# EAGLE design pentabug_v2 (EAGLE 6.5.0)

## Sheet 1 of 4
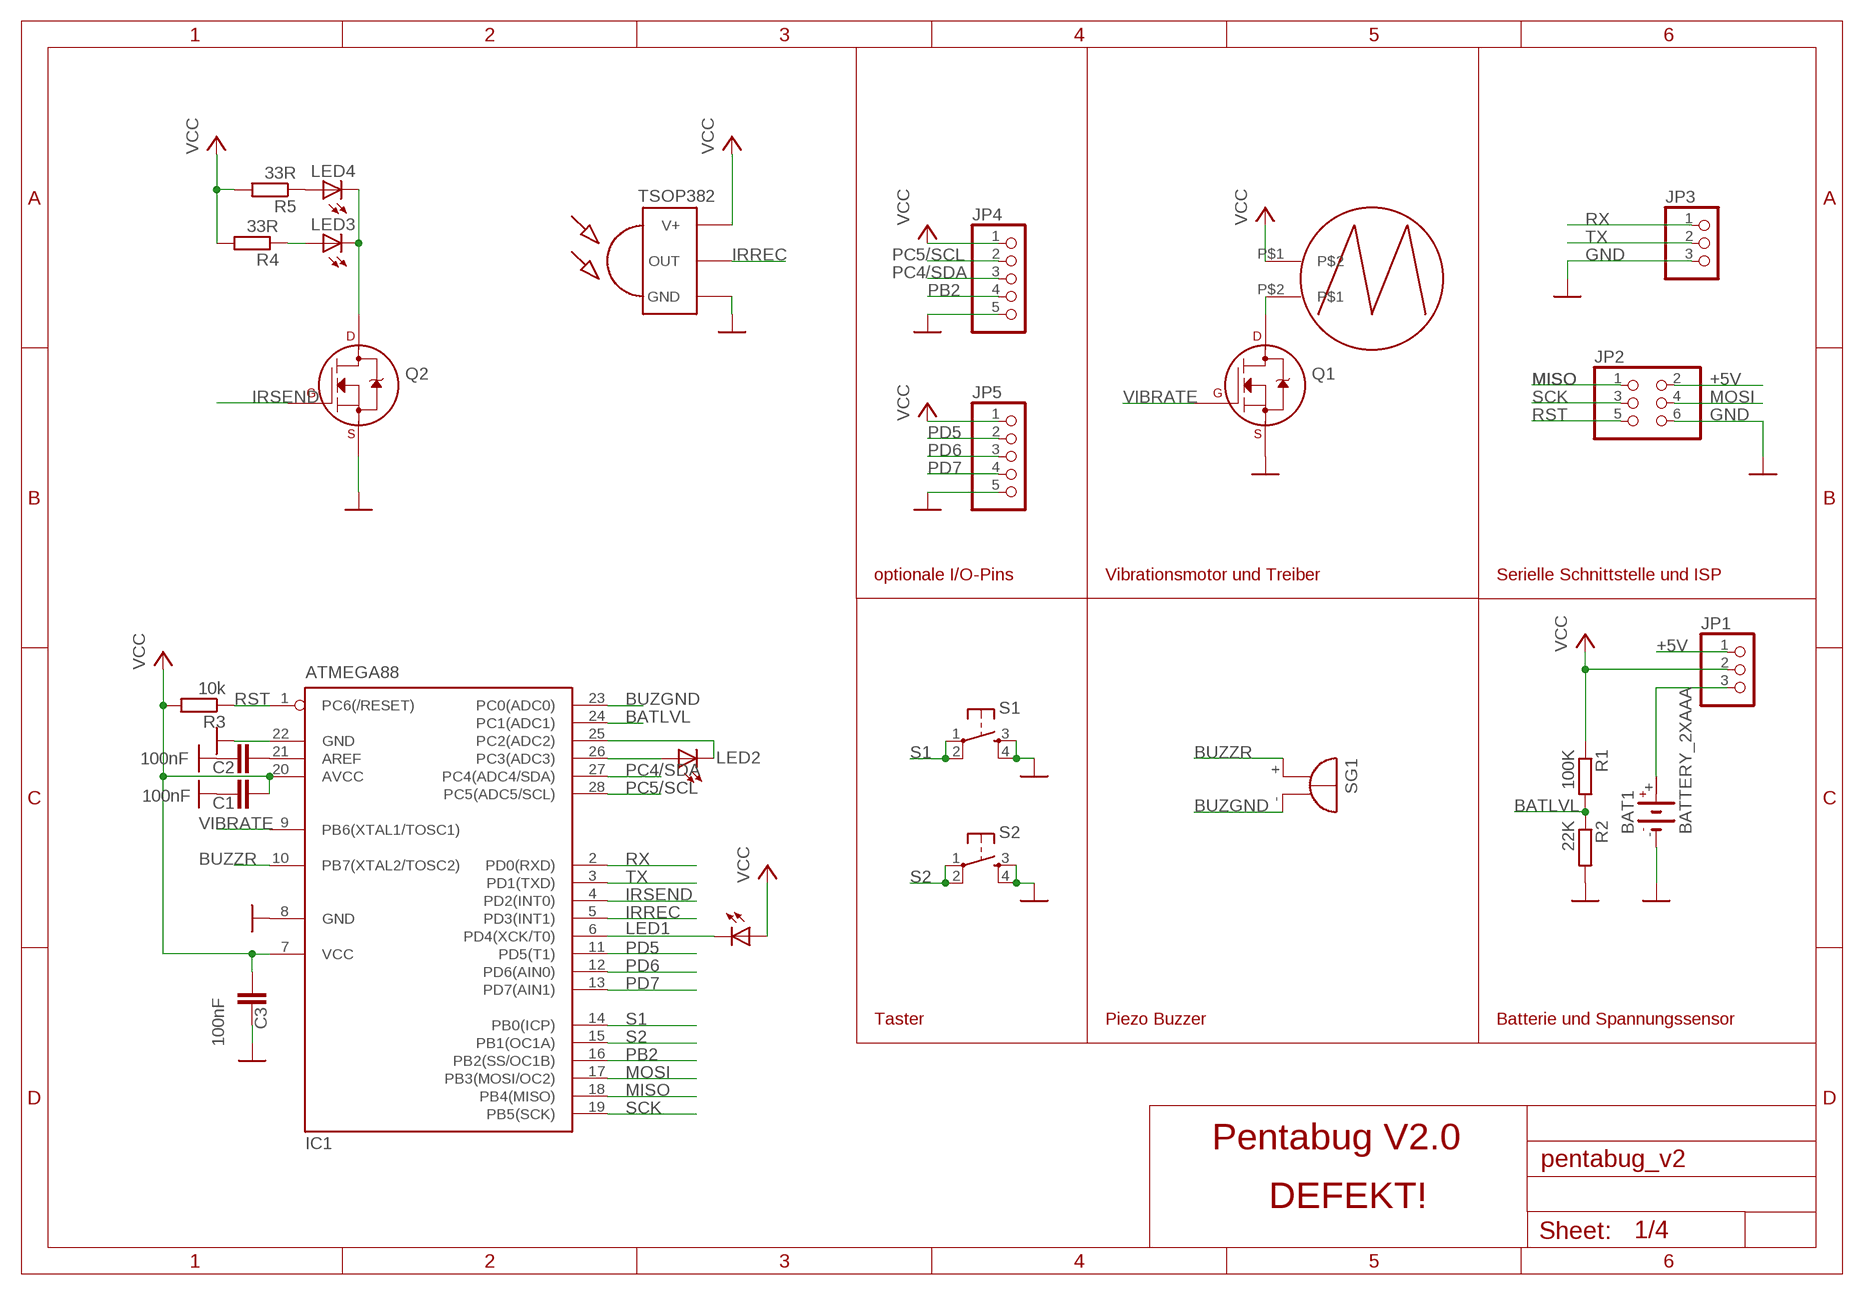
[diagram p0: schematic, sheet 1]

### Parts
BAT1  BATTERY_2XAAA  [BATTERY_2XAAA_SMALLPINS]
C1  100nF  C-EU025-024X044  [C025-024X044]
C2  100nF  C-EU025-024X044  [C025-024X044]
C3  100nF  C-EU025-024X044  [C025-024X044]
IC1  ATMEGA88  MEGA8-P  [DIL28-3]
IR  TSOP382  [TSOP382]
JP1  PINHD-1X3  [1X03]
JP2  PINHD-2X3  [2X03]
JP3  PINHD-1X3  [1X03]
JP4  PINHD-1X5  [1X05]
JP5  PINHD-1X5  [1X05]
LED1  LED5MM  [LED5MM]
LED2  LED5MM  [LED5MM]
LED3  LED3MM  [LED3MM]
LED4  LED3MM  [LED3MM]
Q1  2N7000_TO92  [TO-92]
Q2  2N7000_TO92  [TO-92]
R1  100K  R-EU_0207/10  [0207/10]
R2  22K  R-EU_0207/10  [0207/10]
R3  10k  R-EU_0207/10  [0207/10]
R4  33R  R-EU_0207/10  [0207/10]
R5  33R  R-EU_0207/10  [0207/10]
S1  TAC_SWITCHPTH  [TACTILE-PTH]
S2  TAC_SWITCHPTH  [TACTILE-PTH]
SG1  MULTIBUZZRTDKBUZZR  [BUZZRTDK]
U$1  VIBRAMOTOR  [LA4-432]

### Nets
+5V: JP1.1 JP2.2
BAT: BAT1.+ JP1.3
BATLVL: IC1.24(PC1(ADC1)) R1.2 R2.1
BUZGND: IC1.23(PC0(ADC0)) SG1.-
BUZZR: IC1.10(PB7(XTAL2/TOSC2)) SG1.+
GND: BAT1.- C1.1 C2.1 C3.1 IC1.8(GND) IC1.22(GND) IR.GND JP2.6 JP3.3 JP4.5 JP5.5 Q1.1(S) Q2.1(S) R2.2 S1.3 S1.4 S2.3 S2.4
IRREC: IC1.5(PD3(INT1)) IR.OUT
IRSEND: IC1.4(PD2(INT0)) Q2.2(G)
MISO: IC1.18(PB4(MISO)) JP2.1
MOSI: IC1.17(PB3(MOSI/OC2)) JP2.4
N$3: IC1.26(PC3(ADC3)) LED2.A
N$5: IC1.25(PC2(ADC2)) LED2.K(C)
N$7: LED4.A R5.1
N$8: Q1.3(D) U$1.P$2
N$10: LED3.A R4.1
N$11: LED3.K(C) LED4.K(C) Q2.3(D)
N$12: IC1.6(PD4(XCK/T0)) LED1.K(C)
N$17: C2.2 IC1.21(AREF)
PB2: IC1.16(PB2(SS/OC1B)) JP4.4
PC4/SDA: IC1.27(PC4(ADC4/SDA)) JP4.3
PC5/SCL: IC1.28(PC5(ADC5/SCL)) JP4.2
PD5: IC1.11(PD5(T1)) JP5.2
PD6: IC1.12(PD6(AIN0)) JP5.3
PD7: IC1.13(PD7(AIN1)) JP5.4
RST: IC1.1(PC6(/RESET)) JP2.5 R3.1
RX: IC1.2(PD0(RXD)) JP3.1
S1: IC1.14(PB0(ICP)) S1.1 S1.2
S2: IC1.15(PB1(OC1A)) S2.1 S2.2
SCK: IC1.19(PB5(SCK)) JP2.3
TX: IC1.3(PD1(TXD)) JP3.2
VCC: C1.2 C3.2 IC1.7(VCC) IC1.20(AVCC) IR.VCC(V+) JP1.2 JP4.1 JP5.1 LED1.A R1.1 R3.2 R4.2 R5.2 U$1.P$1
VIBRATE: IC1.9(PB6(XTAL1/TOSC1)) Q1.2(G)

### Notes on the sheet
- optionale I/O-Pins | Vibrationsmotor und Treiber | Serielle Schnittstelle und ISP
- Taster | Piezo Buzzer | Batterie und Spannungssensor
- Pentabug V2.0
- DEFEKT!

## Sheet 2 of 4
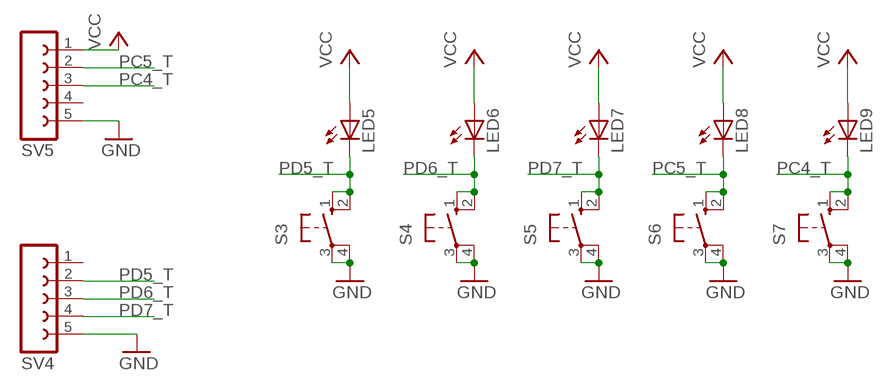
[diagram p1: schematic, sheet 2]

### Parts
LED5  LED5MM  [LED5MM]
LED6  LED5MM  [LED5MM]
LED7  LED5MM  [LED5MM]
LED8  LED5MM  [LED5MM]
LED9  LED5MM  [LED5MM]
S3  10-XX  [B3F-10XX]
S4  10-XX  [B3F-10XX]
S5  10-XX  [B3F-10XX]
S6  10-XX  [B3F-10XX]
S7  10-XX  [B3F-10XX]
SV4  FE05-1  [FE05-1]
SV5  FE05-1  [FE05-1]

### Nets
GND_M: S3.3(P) S3.4(P1) S4.3(P) S4.4(P1) S5.3(P) S5.4(P1) S6.3(P) S6.4(P1) S7.3(P) S7.4(P1) SV4.5 SV5.5 ; supply symbol labelled GND
PC4_T: LED9.K(C) S7.1(S) S7.2(S1) SV5.3
PC5_T: LED8.K(C) S6.1(S) S6.2(S1) SV5.2
PD5_T: LED5.K(C) S3.1(S) S3.2(S1) SV4.2
PD6_T: LED6.K(C) S4.1(S) S4.2(S1) SV4.3
PD7_T: LED7.K(C) S5.1(S) S5.2(S1) SV4.4
VCC_M: LED5.A LED6.A LED7.A LED8.A LED9.A SV5.1 ; supply symbol labelled VCC
Unconnected: SV4.1 SV5.4

## Sheet 3 of 4
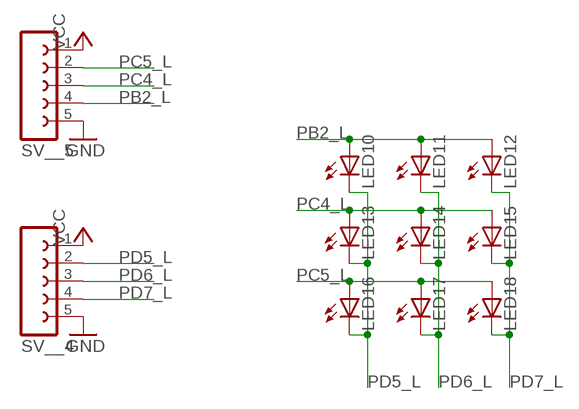
[diagram p2: schematic, sheet 3]

### Parts
LED10  LED5MM  [LED5MM]
LED11  LED5MM  [LED5MM]
LED12  LED5MM  [LED5MM]
LED13  LED5MM  [LED5MM]
LED14  LED5MM  [LED5MM]
LED15  LED5MM  [LED5MM]
LED16  LED5MM  [LED5MM]
LED17  LED5MM  [LED5MM]
LED18  LED5MM  [LED5MM]
SV__4  FE05-1  [FE05-1]
SV__5  FE05-1  [FE05-1]

### Nets
GND_L: SV__4.5 SV__5.5 ; supply symbol labelled GND
PB2_L: LED10.A LED11.A LED12.A SV__5.4
PC4_L: LED13.A LED14.A LED15.A SV__5.3
PC5_L: LED16.A LED17.A LED18.A SV__5.2
PD5_L: LED10.K(C) LED13.K(C) LED16.K(C) SV__4.2
PD6_L: LED11.K(C) LED14.K(C) LED17.K(C) SV__4.3
PD7_L: LED12.K(C) LED15.K(C) LED18.K(C) SV__4.4
VCC_L: SV__4.1 SV__5.1 ; supply symbol labelled VCC

## Sheet 4 of 4

## Library data of the parts
BAT1 = buglbr:BATTERY_2XAAA: Farnell Battery Holder 2x AAA Farnell # 1650679
C1-C3 = resistor:C-EU: CAPACITOR, European symbol
IC1 = atmel:MEGA8-P: MICROCONTROLLER 8 Kbytes FLASH, 1 kbytes SRAM, 512 bytes EEPROM, USART, 4-channel 10 bit ADC, 2-channel 8 bit ADC Pin compatible with Atmega48, ATMega88, ATMega168 Source: avr.lbr; OC_FARNELL: unknown; OC_NEWARK: unknown
IR = buglbr:TSOP382: IR Receiver and Demodulator
JP1 JP3 = pinhead:PINHD-1X3: PIN HEADER
JP2 = pinhead:PINHD-2X3: PIN HEADER
JP4 JP5 = pinhead:PINHD-1X5: PIN HEADER
LED1-LED4 = SparkFun:LED: LEDs Standard schematic elements and footprints for 5mm, 3mm, 1206, and 0603 sized LEDs. 5mm - Spark Fun Electronics SKU : COM-00529 (and others)
LED5-LED18 = led:LED: LED OSRAM: - CHIPLED LG R971, LG N971, LY N971, LG Q971, LY Q971, LO R971, LY R971 LH N974, LH R974 LS Q976, LO Q976, LY Q976 LO Q996 - Hyper CHIPLED LW Q18S LB Q993, LB Q99A, LB R99A - SideLED LS A670, LO A670, LY A670, LG A670, LP A670 LB A673, LV A673, LT A673, LW A673 LH A674 LY A675 LS A676, LA A676, LO A676, LY A676, LW A676 LS A679, LY A679, LG A679 - Hyper Micro SIDELED® LS Y876, LA Y876, LO Y876, LY Y876 LT Y87S - SmartLED LW L88C, LW L88S LB L89C, LB L89S, LG L890 LS L89K, LO L89K, LY L89K LS L896, LA L896, LO L896, LY L896 - TOPLED LS T670, LO T670, LY T670, LG T670, LP T670 LSG T670, LSP T670, LSY T670, LOP T670, LYG T670 LG T671, LOG T671, LSG T671 LB T673, LV T673, LT T673, LW T673 LH T674 LS T676, LA T676, LO T676, LY T676, LB T676, LH T676, LSB T676, LW T676 LB T67C, LV T67C, LT T67C, LS T67K, LO T67K, LY T67K, LW E67C LS E67B, LA E67B, LO E67B, LY E67B, LB E67C, LV E67C, LT E67C LW T67C LS T679, LY T679, LG T679 LS T770, LO T770, LY T770, LG T770, LP T770 LB T773, LV T773, LT T773, LW T773 LH T774 LS E675, LA E675, LY E675, LS T675 LS T776, LA T776, LO T776, LY T776, LB T776 LHGB T686 LT T68C, LB T68C - Hyper Mini TOPLED® LB M676 - Mini TOPLED Santana® LG M470 LS M47K, LO M47K, LY M47K Source: http://www.osram.convergy.de LUXEON: - LUMILED® LXK2-PW12-R00, LXK2-PW12-S00, LXK2-PW14-U00, LXK2-PW14-V00 LXK2-PM12-R00, LXK2-PM12-S00, LXK2-PM14-U00 LXK2-PE12-Q00, LXK2-PE12-R00, LXK2-PE12-S00, LXK2-PE14-T00, LXK2-PE14-U00 LXK2-PB12-K00, LXK2-PB12-L00, LXK2-PB12-M00, LXK2-PB14-N00, LXK2-PB14-P00, LXK2-PB14-Q00 LXK2-PR12-L00, LXK2-PR12-M00, LXK2-PR14-Q00, LXK2-PR14-R00 LXK2-PD12-Q00, LXK2-PD12-R00, LXK2-PD12-S00 LXK2-PH12-R00, LXK2-PH12-S00 LXK2-PL12-P00, LXK2-PL12-Q00, LXK2-PL12-R00 Source: www.luxeon.com KINGBRIGHT: KA-3528ASYC Source: www.kingbright.com
Q1 Q2 = transistors:2N700*: 2N7000, 2N7002, NDS7002A N-channel enhancement mode MOSFET
R1-R5 = rcl:R-EU_: RESISTOR, European symbol
S1 S2 = SparkFun:TAC_SWITCH: Momentary Switch Button commonly used for reset or general input. Spark Fun Electronics SKU : COM-00097
S3-S7 = switch-omron:10-XX: OMRON SWITCH; MPN: B3F-1000; OC_FARNELL: 176432; OC_NEWARK: 36M3542
SG1 = buglbr:MULTIBUZZR: BUZZER TDK PS1720P02 http://de.mouser.com/ProductDetail/TDK/PS1720P02/?qs=%2fha2pyFadujtCAfY3DKBdXuzQLwQogEgrqwqrrNaKDmjrMwApyDRCA%3d%3d
SV4 SV5 SV__4 SV__5 = con-lsta:FE05-1: FEMALE HEADER; OC_FARNELL: unknown; OC_NEWARK: unknown
U$1 = buglbr:VIBRAMOTOR

## Board
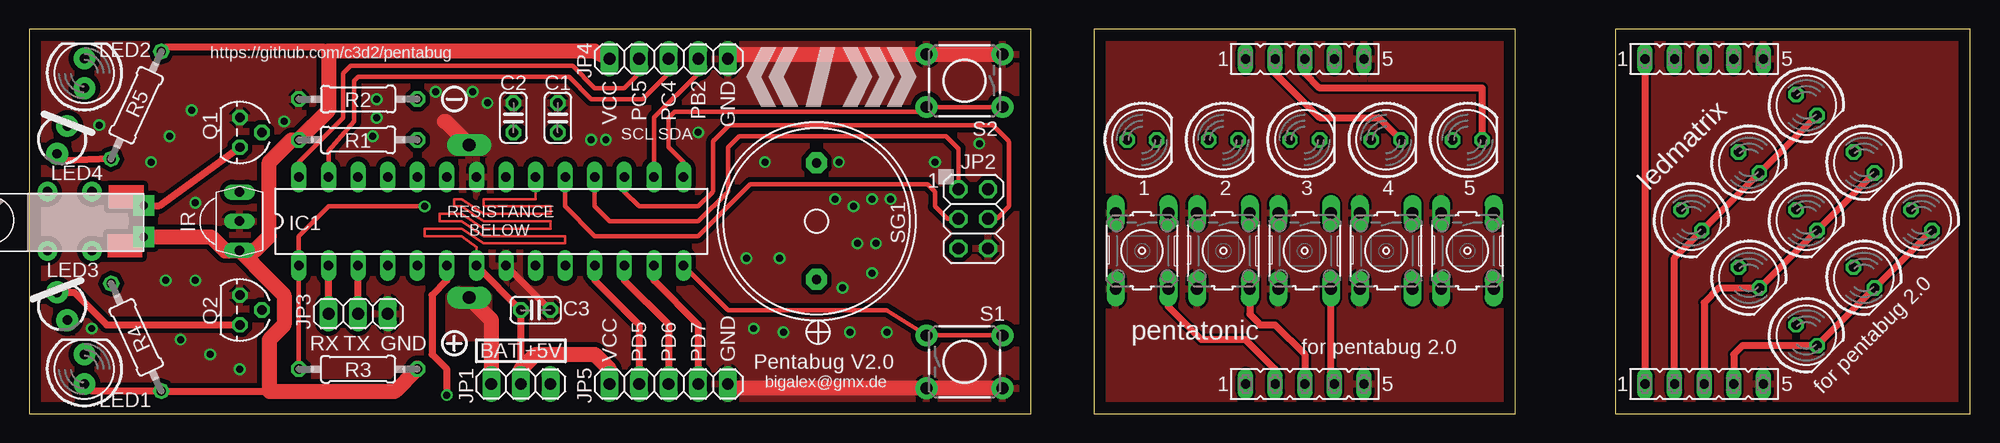
[diagram p3: board, top side]
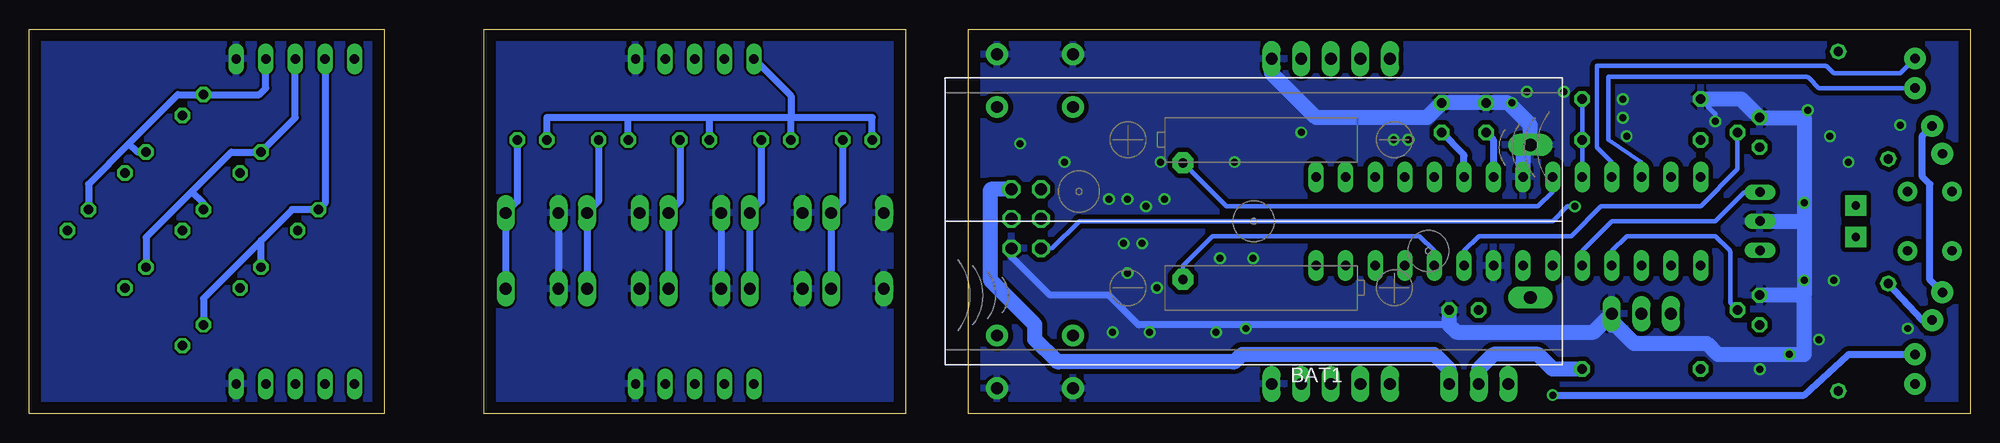
[diagram p4: board, bottom side, seen from below]

Size 166.67 x 33 mm. Coordinates in mm from the lower left corner, seen from the top.
Outline: 86.03,0 86.03,33 0,33 0,0 86.03,0
Outline: 91.43,0 127.62,0 127.62,33 91.43,33 91.43,0
Outline: 136.19,0 166.67,0 166.67,33 136.19,33 136.19,0
Copper layers (1*16): Top 0.035mm / dielectric 1.5mm / Bottom 0.035mm
Design rules "default *": minimum track width 8mil, minimum drill 0.6mm, track to track 8mil, track to pad 8mil, pad to pad 8mil, via to via 8mil, smd to smd 8mil, copper to edge 40mil, drill to drill 8mil, minimum pad ring 10mil, minimum via ring 8mil, stop-mask expansion 4mil, vias tented up to drill 0.8mm, thermal gap 10mil

### Footprints (pad centres in the part's own frame; a part is rotated, then mirrored left to right if it is on the bottom)
BATTERY_2XAAA_SMALLPINS = drill 1.1 pad 1.905 long: + -23.75,6.55; - -23.75,-6.55
C025-024X044 = drill 0.813 octagon: 1 -1.27,0; 2 1.27,0
DIL28-3 = drill 0.813 long: 1 -16.51,-3.81; 2 -13.97,-3.81; 3 -11.43,-3.81; 4 -8.89,-3.81; 5 -6.35,-3.81; 6 -3.81,-3.81; 7 -1.27,-3.81; 8 1.27,-3.81; 9 3.81,-3.81; 10 6.35,-3.81; 11 8.89,-3.81; 12 11.43,-3.81; 13 13.97,-3.81; 14 16.51,-3.81; 15 16.51,3.81; 16 13.97,3.81; 17 11.43,3.81; 18 8.89,3.81; 19 6.35,3.81; 20 3.81,3.81; 21 1.27,3.81; 22 -1.27,3.81; 23 -3.81,3.81; 24 -6.35,3.81; 25 -8.89,3.81; 26 -11.43,3.81; 27 -13.97,3.81; 28 -16.51,3.81
TSOP382 = drill 0.813 long: GND -0.001,-0.027; OUT -2.501,-0.027; VCC 2.499,-0.027
1X03 = drill 1.016 long: 1 -2.54,0; 2 0,0; 3 2.54,0
2X03 = drill 1.016 octagon: 1 -2.54,-1.27; 2 -2.54,1.27; 3 0,-1.27; 4 0,1.27; 5 2.54,-1.27; 6 2.54,1.27
1X05 = drill 1.016 long: 1 -5.08,0; 2 -2.54,0; 3 0,0; 4 2.54,0; 5 5.08,0
LED5MM = drill 0.813 pad 1.88: A -1.27,0; K 1.27,0
LED3MM = drill 0.813 pad 1.88: A -1.27,0; K 1.27,0
LED5MM' = drill 0.813 octagon: A -1.27,0; K 1.27,0
TO-92 = drill 0.813 octagon: 1 -1.27,0; 2 0,1.905; 3 1.27,0
0207/10 = drill 0.813 octagon: 1 -5.08,0; 2 5.08,0
TACTILE-PTH = drill 1.016 pad 1.88: 1 -3.251,2.261; 2 3.251,2.261; 3 -3.251,-2.261; 4 3.251,-2.261
B3F-10XX = drill 1.016 long: 1 -3.251,2.261; 2 3.251,2.261; 3 -3.251,-2.261; 4 3.251,-2.261
BUZZRTDK = drill 0.8 pad 1.8 octagon: + 5,0; - -5,0
FE05-1 = drill 0.813 long: 1 -5.08,0; 2 -2.54,0; 3 0,0; 4 2.54,0; 5 5.08,0
LA4-432 = drill 0.7 pad 1.778 square: P$1 -6.985,1.35; P$2 -6.985,-1.35

### Placement (x,y rotation side)
BAT1  61.53,16.51 180 bottom
C1  45.39,25.4 270 top
C2  41.58,25.4 270 top
C3  43.48,8.89 180 top
IC1  39.67,16.51 0 top
IR  18.09,16.51 270 top
JP1  42.21,2.54 180 top
JP2  81.07,16.71 270 top
JP3  28.25,8.57 0 top
JP4  54.91,30.45 0 top
JP5  54.91,2.54 0 top
LED1  4.75,3.81 90 top
LED2  4.75,29.21 90 top
LED3  2.85,9.21 110 top
LED4  2.85,23.5 70 top
LED5  [LED5MM']  95.55,23.5 0 top
LED6  [LED5MM']  102.54,23.5 0 top
LED7  [LED5MM']  109.52,23.5 0 top
LED8  [LED5MM']  116.51,23.5 0 top
LED9  [LED5MM']  123.49,23.5 0 top
LED10  [LED5MM']  152.6,26.48 315 top
LED11  [LED5MM']  157.54,21.54 315 top
LED12  [LED5MM']  162.47,16.6 315 top
LED13  [LED5MM']  147.66,21.54 315 top
LED14  [LED5MM']  152.6,16.6 315 top
LED15  [LED5MM']  157.54,11.66 315 top
LED16  [LED5MM']  142.72,16.6 315 top
LED17  [LED5MM']  147.66,11.66 315 top
LED18  [LED5MM']  152.6,6.72 315 top
Q1  18.09,24.13 270 top
Q2  18.09,8.89 270 top
R1  28.25,23.5 0 top
R2  28.25,26.99 180 top
R3  28.25,3.81 0 top
R4  9.2,6.55 295 top
R5  9.2,26.47 65 top
S1  80.31,4.45 0 top
S2  80.31,28.57 180 top
S3  95.55,13.97 270 top
S4  102.54,13.97 270 top
S5  109.52,13.97 270 top
S6  116.51,13.97 270 top
S7  123.49,13.97 270 top
SG1  67.61,16.51 270 top
SV4  109.52,2.54 0 top
SV5  109.52,30.45 0 top
SV__4  143.81,2.54 0 top
SV__5  143.81,30.45 0 top
U$1  2.85,16.51 180 top

### Tracks (layer width: path | path; a pad name or v marks a point on that pad's centre or on a via)
+5V
  Bottom 1.27: JP2.2 84.12,19.25 84.12,11.54 arc-45 84.05,11.36 80.39,7.69 arc45 80.31,7.51 80.31,6.35 78.48,4.52 arc-45 78.3,4.45 63.27,4.45 arc-45 63.1,4.52 62.53,5.08 46.02,5.08 44.83,3.88 arc45 44.75,3.71 JP1.1
BAT
  Top 1.27: BAT1.+ 39.6,8.14 arc-45 39.67,7.96 JP1.3
  pour Top (no thermals): 36.82,10.79 35.86,10.16 35.86,6.35 39.67,6.35 39.67,10.16 38.09,10.79
BATLVL
  Bottom 0.406: R2.1 R1.2 IC1.24
BUZGND
  Bottom 0.406: IC1.23 35.86,19.05 37.13,17.78 63.88,17.78 SG1.-
BUZZR
  Bottom 0.406: SG1.+ 67.61,12.7 65.08,15.24 47.29,15.24 46.02,13.97 IC1.10
GND  (via drill 0.6)
  Top 0.61: IC1.8 C3.1
  Top 1.27: 35.66,25.08 arc-45 35.84,25.01 BAT1.- | JP4.5 60.31,30.76 arc-45 60.49,30.84 S2.4 S2.3 | S1.4 S1.3 60.46,2.18 arc-45 60.28,2.26 JP5.5
  Bottom 0.406: v21.89,25.08 21.89,25.61 arc-45 21.97,25.79 R2.2
  Bottom 0.61: 44.75,7.62 71.42,7.62 73.89,10.09 arc-45 74.07,10.16 79.05,10.16 82.26,13.38 arc45 82.34,13.56 JP2.6
  Bottom 1.27: IC1.22 38.4,22.44 BAT1.- 37.78,24.78 39.67,26.67 C2.1 C1.1 46.59,25.47 arc45 46.76,25.4 56.18,25.4 59.92,29.14 arc45 59.99,29.32 JP4.5 | 14.28,16.51 14.28,25.4 Q1.1 19.67,26.99 R2.2 | 14.28,16.51 14.28,10.16 | 14.28,10.16 Q2.1 | IR.GND 14.28,16.51 | C3.1 44.75,7.62 44.19,7.06 arc-45 44.01,6.99 32.48,6.99 arc-45 32.3,7.06 JP3.3 30.79,7.62 30.57,7.62 arc45 30.39,7.55 28.88,6.03 22.64,6.03 21.76,5.15 arc-45 21.58,5.08 14.28,5.08 14.28,10.16
  other vias: 29.83,25.4 29.83,26.99 29.52,23.81 34.91,27.62 57.45,24.13 38.09,27.62 39.36,26.67 48.25,23.5 49.52,23.5 63.17,21.59 69.52,21.59 81.58,23.18 77.77,21.59 73.97,18.41 72.38,18.41 70.79,17.78 69.2,18.41 72.69,14.61 71.11,14.61 64.44,13.34 61.58,13.34 72.38,12.06 69.84,10.79 62.22,7.3 64.76,6.99 70.47,6.99 73.65,6.99 18.09,3.81 15.55,5.08 13.01,6.35 11.73,11.43 14.28,11.43 14.28,18.1 10.46,21.59 12.05,23.81 13.96,26.04 6.02,24.77 5.38,7.3
  pour Top (isolate 0.406): -0.96,0 -0.96,34.29 86.03,34.29 86.03,0
  pour Bottom (isolate 0.406): -0.96,0 -0.96,34.29 86.03,34.61 86.03,0.32
  pour Top (no thermals): 35.55,22.23 39.99,22.23 39.99,24.13 38.4,25.4 35.55,25.4
GND_L
  pour Top: 136.19,33.02 166.67,33.02 166.67,0 136.19,0
  pour Bottom: 136.19,33.02 166.67,33.02 166.67,0 136.19,0
GND_M
  Bottom 0.61: S5.3 S5.4 | S7.3 S7.4
  pour Top: 91.74,0 127.31,0 127.31,33.02 91.74,33.02
  pour Bottom: 91.74,33.02 127.31,33.02 127.31,0 91.74,0
IRREC
  Bottom 0.406: IC1.5 33.32,13.87 arc45 33.25,14.04 30.86,16.44 arc45 30.68,16.51 21.89,16.51 19.47,18.94 arc45 19.29,19.01 IR.OUT
IRSEND
  Bottom 0.406: IC1.4 30.79,13.97 29.52,15.24 21.89,15.24 20.7,14.04 arc45 20.62,13.87 20.62,9.63 arc-45 20.55,9.45 Q2.2
MISO
  Top 0.406: IC1.18 48.56,17.78 49.83,16.51 57.45,16.51 59.99,19.05 59.99,22.86 60.95,23.81 78.73,23.81 79.8,22.74 JP2.1
MOSI
  Top 0.406: IC1.17 51.1,19.05 52.38,17.78 57.45,17.78 58.65,18.98 arc45 58.72,19.16 58.72,23.29 arc-45 58.8,23.46 60.1,24.77 82.75,24.77 84.05,23.46 arc-45 84.12,23.29 84.12,17.78 83.13,16.78 arc-45 82.95,16.71 JP2.4
N$1  (via drill 0.8 pad 1.68)
  other vias: 1.58,19.05
N$2  (via drill 0.8 pad 1.68)
  other vias: 5.38,19.05
N$3
  Bottom 0.406: IC1.26 28.25,21.59 31.1,23.5 31.1,28.89 14.06,28.89 arc45 13.88,28.82 13.01,27.94 LED2.A
N$4  (via drill 0.8 pad 1.68)
  other vias: 5.38,13.97
N$5
  Bottom 0.406: IC1.25 30.79,21.59 32.05,22.86 32.05,29.84 12.47,29.84 arc45 12.3,29.77 11.73,29.21 6.12,29.21 arc-45 5.95,29.28 LED2.K
N$6  (via drill 0.8 pad 1.68)
  other vias: 1.58,13.97
N$7
  Top 0.61: R5.1 3.02,21.7 arc-90 LED4.A
N$8
  Top 0.61: U$1.P$2 11.18,17.86 Q1.3
N$10
  Bottom 0.61: LED3.A 4.15,8.01 R4.1
N$11
  Top 0.61: LED3.K 3.87,10.4 6.66,7.62 Q2.3
  Bottom 0.61: LED4.K 4.12,23.85 4.12,20.32 3.48,19.68 3.48,11.47 LED3.K
N$12  (via drill 0.6)
  Top 0.61: IC1.6 35.86,11.43 34.59,10.16 34.59,5.08 35.79,3.88 arc-45 35.86,3.71 v35.86,1.59
  Bottom 0.61: v35.86,1.59 14.28,1.59 10.54,5.01 arc45 10.36,5.08 LED1.K
N$17
  Bottom 0.61: C2.2 41.02,23.57 arc45 40.94,23.39 IC1.21
PB2
  Top 0.406: IC1.16 53.64,25.3 arc-45 53.72,25.47 57.38,29.14 arc45 57.45,29.32 JP4.4
PB2_L
  Bottom 0.61: 158.1,23.18 161.58,19.7 LED12.A | LED11.A 157.36,22.44 158.1,23.18 | 158.1,23.18 153.9,27.38 LED10.A 146.92,27.38 146.35,27.94 SV__5.4
PC4/SDA
  Top 0.406: JP4.3 54.91,29.21 52.69,26.99 48.25,26.99 46.34,28.89 28.25,28.89 27.93,28.57 27.93,25.08 25.71,22.54 IC1.27
PC4_L
  Bottom 0.61: 152.7,19.05 149.32,22.44 LED13.A 146.76,22.46 143.81,25.4 SV__5.3 | 152.7,19.05 156.64,15.12 LED15.A | LED14.A 151.7,18.04 152.7,19.05
PC4_T
  Top 0.61: LED9.K 124.77,27.94 110.8,27.94 109.52,29.21 SV5.3
  Bottom 0.61: LED9.K 124.77,18.21 S7.1 | S7.1 125.76,17.5 126.03,17.78 | S7.1 S7.2
PC5/SCL
  Top 0.406: JP4.2 52.38,29.21 51.1,27.94 48.56,27.94 46.66,29.84 27.61,29.84 26.98,29.21 26.98,25.4 23.16,21.59 IC1.28
PC5_L
  Bottom 0.61: SV__5.2 141.28,18.04 LED16.A 144.1,17.5 146.76,14.84 | 146.76,14.84 151.7,9.9 LED18.A | LED17.A 146.76,14.84
PC5_T
  Top 0.61: SV5.2 106.98,29.21 110.8,25.4 115.88,25.4 LED8.K
  Bottom 0.61: LED8.K 117.78,18.21 S6.1 S6.2
PD5
  Top 0.61: IC1.11 48.56,11.43 52.38,7.62 JP5.2
PD5_L
  Top 0.61: SV__4.2 141.28,13.36 142.85,14.94 LED16.K | LED16.K LED10.K | LED13.K LED16.K
PD5_T
  Top 0.61: SV4.2 106.98,3.81 104.44,6.35 100.63,6.35 97.82,9.17 S3.2
  Bottom 0.61: LED5.K 96.83,18.21 S3.1 S3.2
PD6
  Top 0.61: IC1.12 51.1,11.43 54.84,7.69 arc-45 54.91,7.51 JP5.3
PD6_L
  Top 0.61: LED11.K LED14.K LED17.K 145.05,10.76 143.81,9.53 SV__4.3
PD6_T
  Top 0.61: S4.2 104.8,8.53 105.72,7.62 106.98,7.62 109.52,5.08 SV4.3
  Bottom 0.61: LED6.K 103.81,18.21 S4.1 S4.2
PD7
  Top 0.61: IC1.13 53.64,11.43 57.45,7.62 JP5.4
PD7_L
  Top 0.61: LED12.K LED15.K LED18.K 147.1,5.82 146.35,5.08 SV__4.4
PD7_T
  Top 0.61: SV4.4 111.79,2.54 S5.2
  Bottom 0.61: LED7.K 110.8,18.21 S5.1 S5.2
RST  (via drill 0.6)
  Top 0.406: v33.96,17.78 25.71,17.78 23.16,15.24 IC1.1 R3.1
  Bottom 0.406: JP2.5 78.84,14.17 76.5,16.51 35.86,16.51 34.59,17.78 v33.96,17.78
RX
  Top 0.61: JP3.1 IC1.2
S1
  Top 0.406: S1.2 S1.1 73.61,8.89 59.99,8.89 IC1.14
S2
  Top 0.406: S2.1 S2.2 76.67,25.92 55.44,25.92 54.91,25.4 54.91,22.86 56.18,21.59 IC1.15
SCK
  Top 0.406: IC1.19 46.02,17.78 48.56,15.24 57.45,15.24 61.9,19.68 77.14,19.68 77.77,19.05 77.77,17.78 78.84,16.71 JP2.3
TX
  Top 0.61: JP3.2 IC1.3
VCC
  Top 0.203: IC1.7 38.4,14.29 37.13,15.24 33.96,15.24 33.96,15.88 37.13,15.88 39.04,14.61 46.02,14.61 46.02,15.24 39.04,15.24 37.13,16.51 35.23,16.51 35.23,17.14 37.13,17.14 39.04,15.88 44.75,15.88 44.75,16.51 39.04,16.51 37.13,17.78 36.5,17.78 36.5,18.41 37.13,18.41 39.04,17.14 44.75,17.14 44.75,17.78 39.04,17.78 39.04,18.41 43.48,18.41 IC1.20
  Top 0.61: IC1.7 C3.2 42.21,3.81 | 25.71,31.11 25.39,31.43 11.73,31.43 11.23,31.24 R5.2 | LED1.A 5.27,2.02 arc45 5.45,1.95 R4.2 arc45 11.44,1.91 20.62,1.91
  Top 1.27: JP4.1 48.56,31.11 25.71,31.11 25.71,26.04 R1.1 22.53,23.5 20.62,21.59 20.62,15.24 19.4,14.01 IR.VCC | U$1.P$1 15.62,15.16 16.82,13.97 18.02,13.97 IR.VCC | JP5.1 49.83,3.81 48.56,5.08 43.48,5.08 42.21,3.81 JP1.2 | IR.VCC 20.62,11.45 20.62,11.43 21.89,10.16 21.89,7.62 20.62,6.35 20.62,1.91 31.32,1.91 arc45 31.49,1.98 33.25,3.74 arc45 33.32,3.92 R3.2
  Bottom 0.61: IC1.20 43.48,22.12 arc-45 43.56,22.3 C1.2
  Bottom 1.27: 42.21,3.81 JP1.2 42.21,3.71 arc45 42.14,3.88 40.94,5.08 37.13,5.08 35.94,3.88 arc-45 35.76,3.81 R3.2
VCC_L
  Top 0.61: SV__5.1 SV__4.1
VCC_M
  Bottom 0.61: SV5.1 101.27,27.27 101.27,25.4 | LED5.A 94.28,25.4 101.27,25.4 | LED6.A 101.27,25.4 | 101.27,25.4 108.25,25.4 | 108.25,25.4 115.24,25.4 | 115.24,25.4 122.22,25.4 LED9.A | LED7.A 108.25,25.4 | LED8.A 115.24,25.4
VIBRATE
  Bottom 0.406: IC1.9 43.48,13.97 42.21,15.24 34.28,15.24 31.74,17.78 23.16,17.78 19.99,20.95 Q1.2

### Text on the board
tNames: https://github.com/c3d2/pentabug | VCC | PC5 | PC4 | PB2 | GND | SCL | SDA | 1 | 1 | 2 | 3 | 4 | 5 | ledmatrix | RESISTANCE | IR | BELOW | pentatonic | RX | TX | GND | BAT | +5V | for pentabug 2.0 | VCC | PD5 | PD6 | PD7 | GND | Pentabug V2.0 | bigalex@gmx.de | for pentabug 2.0